# Altium schematic sheet DemoSchematic.SchDoc
size A; SheetNumber: 1; SheetTotal: 1
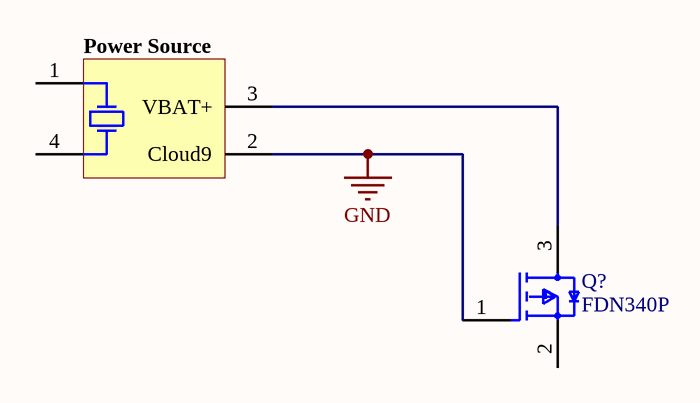
[diagram p0: DemoSchematic.SchDoc]

## Parts
Power_Source  M4T28-BR12SH1  [STM-M4T28-BR12SH-4_V]  (value not drawn)
Q?  FDN340P  [FP-527AG-MFG]

## Nets
GND: Power_Source.2(Cloud9) Q?.1(G)
NetPower_Source_3: Power_Source.3(VBAT+) Q?.3(D)

Not connected (* = marked no-connect by the designer): Power_Source 1(X1) 4(X2); Q? 2(S)

## Library data of the parts
Power_Source = CMP-2000-05371-1: Real-Time Clock and TIMEKEEPER(R) SNAPHAT(R) Battery with Crystal, 48 mAH, 2.8 V, 32.768 KHz, 0 to 70 degC, 4-Pin THD, RoHS, Tube; Manufacturer: STMicroelectronics; No. of Pins: 4; Battery Capacity: 48mAh; Load Capacitance: 12.5pF; Supply Voltage: 2.8V; Digital IC Case: SMD; SVHC: NoSVHC(17-Dec-2015); Battery Type: Lithium; Operating Temperature Max: 70degC; Manufacturer URL: http://www.st.com/; Oscillator Frequency: 32.768kHz; Datasheet Version: Rev. 3, 11/2008; Product Range: -; Datasheet URL: https://datasheet.ciiva.com/26795/m4t28-br12sh1-26795299.pdf; Package Reference: STM-M4T28-BR12SH-4; Packaging: Each; MSL: -; Operating Temperature Min: 0degC
Q? = CMP-2100-03638-2: MOSFET P-CH 20V 2A SSOT3; Fall Time: 11ns; Rise Time: 9ns; Voltage Rating (DC): -20V; Power Dissipation: 500mW; Nominal Vgs: -800mV; Current Rating: -2A; Gate to Source Voltage (Vgs): 8V; Rds On Max: 70mR; Turn-Off Delay Time: 27ns; Element Configuration: Single; Number of Elements: 1; Input Capacitance: 779pF; Drain to Source Resistance: 60mR; Turn-On Delay Time: 10ns; Package Quantity: 1; Mount: Surface Mount; Case/Package: SOT-23; Min Operating Temperature: -55°C; REACH SVHC: No SVHC; Weight: 0.03g; Packaging: Tape and Reel; Threshold Voltage: -800mV; Max Operating Temperature: 150°C; Dual Supply Voltage: -20V; Termination: SMD/SMT; Drain to Source Voltage (Vdss): 20V; Height: 0.94mm; Length: 2.92mm; Contact Plating: Tin; Width: 3.05mm; Drain to Source Breakdown Voltage: -20V; Max Power Dissipation: 500mW; Continuous Drain Current (ID): 2A; Number of Pins: 3; Lead Free: Lead Free; Radiation Hardening: No; On-State Resistance: 70MR